# EAGLE design lcd (EAGLE 7.7.0)
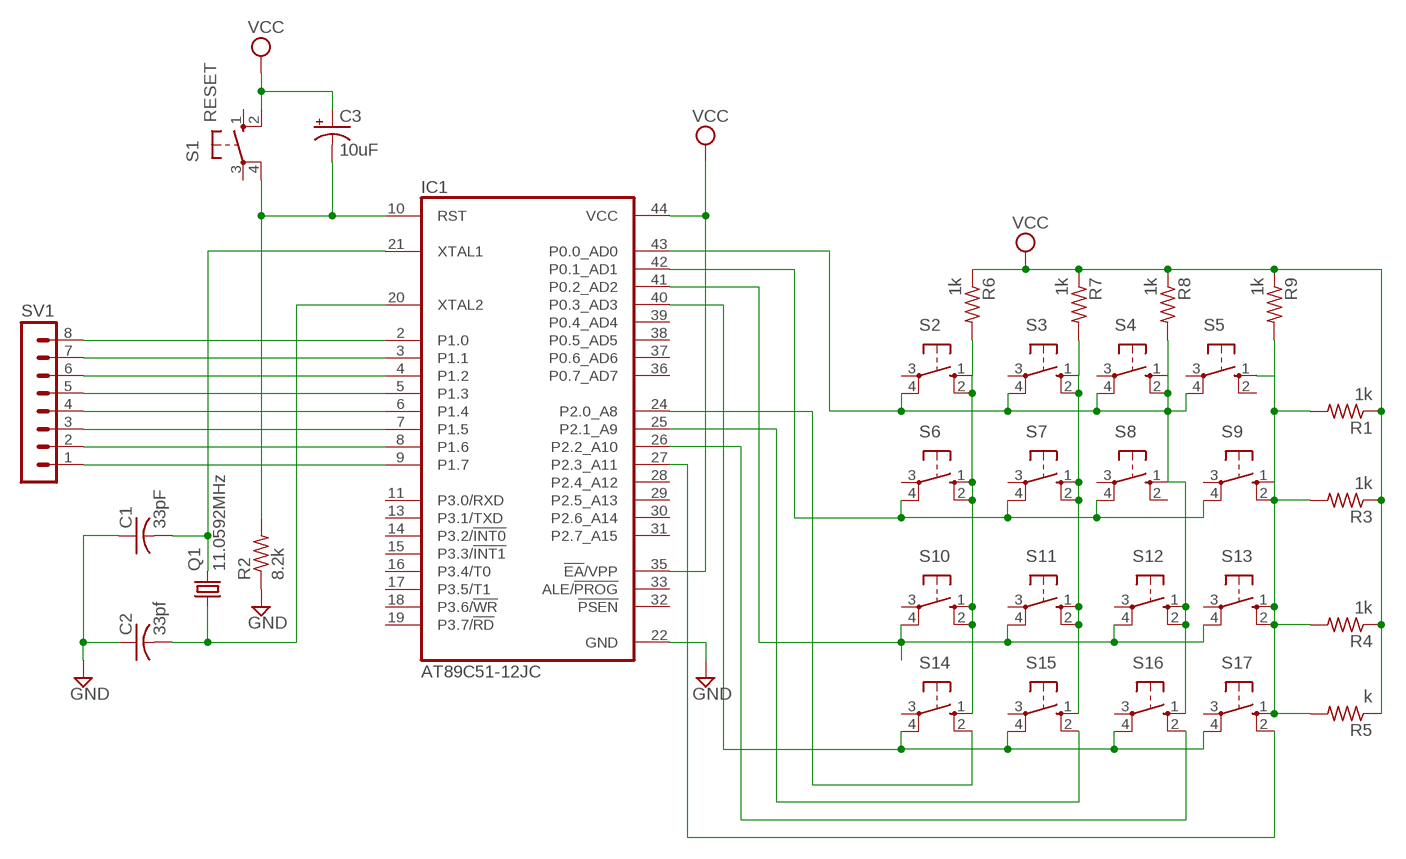
[diagram p0: schematic, sheet 1]

## Parts
C1  33pF  C-US025-025X050  [C025-025X050]
C2  33pf  C-US025-025X050  [C025-025X050]
C3  10uF  CPOL-USE2.5-5  [E2,5-5]
IC1  AT89C51-12JC  [PLCC44]
Q1  11.0592MHz  CRYSTALTC26H  [TC26H]
R1  1k  R-US_R2512  [R2512]
R2  8.2k  R-US_R2512  [R2512]
R3  1k  R-US_R2512  [R2512]
R4  1k  R-US_R2512  [R2512]
R5  k  R-US_R2512  [R2512]
R6  1k  R-US_R2512  [R2512]
R7  1k  R-US_R2512  [R2512]
R8  1k  R-US_R2512  [R2512]
R9  1k  R-US_R2512  [R2512]
S1  RESET  10-XX  [B3F-10XX]
S2  10-XX  [B3F-10XX]
S3  10-XX  [B3F-10XX]
S4  10-XX  [B3F-10XX]
S5  10-XX  [B3F-10XX]
S6  10-XX  [B3F-10XX]
S7  10-XX  [B3F-10XX]
S8  10-XX  [B3F-10XX]
S9  10-XX  [B3F-10XX]
S10  10-XX  [B3F-10XX]
S11  10-XX  [B3F-10XX]
S12  10-XX  [B3F-10XX]
S13  10-XX  [B3F-10XX]
S14  10-XX  [B3F-10XX]
S15  10-XX  [B3F-10XX]
S16  10-XX  [B3F-10XX]
S17  10-XX  [B3F-10XX]
SV1  MA08-1W  [MA08-1W]

## Nets
GND: C1.1 C2.1 IC1.22(GND) R2.1
N$1: IC1.9(P1.7) SV1.1
N$2: IC1.8(P1.6) SV1.2
N$3: IC1.7(P1.5) SV1.3
N$4: IC1.6(P1.4) SV1.4
N$5: IC1.5(P1.3) SV1.5
N$6: IC1.4(P1.2) SV1.6
N$7: IC1.3(P1.1) SV1.7
N$8: IC1.2(P1.0) SV1.8
N$9: IC1.43(P0.0_AD0) R8.2 S2.4(P1) S3.4(P1) S4.1(S) S4.2(S1) S4.4(P1) S5.4(P1) S8.1(S) S12.1(S) S12.2(S1) S16.1(S)
N$10: IC1.42(P0.1_AD1) S6.4(P1) S7.4(P1) S8.4(P1) S9.4(P1)
N$11: IC1.41(P0.2_AD2) S10.4(P1) S11.4(P1) S12.4(P1) S13.4(P1)
N$12: C1.2 IC1.21(XTAL1) Q1.2
N$13: C2.2 IC1.20(XTAL2) Q1.1
N$14: IC1.40(P0.3_AD3) S14.4(P1) S15.4(P1) S16.4(P1) S17.4(P1)
N$15: IC1.25(P2.1_A9) S15.2(S1)
N$17: C3.- IC1.10(RST) R2.2 S1.4(P1)
N$18: IC1.24(P2.0_A8) S14.2(S1)
N$19: R6.2 S2.1(S) S2.2(S1) S6.1(S) S6.2(S1) S10.1(S) S10.2(S1) S14.1(S)
N$20: R7.2 S3.1(S) S3.2(S1) S7.1(S) S7.2(S1) S11.1(S) S11.2(S1) S15.1(S)
N$22: R1.2 R3.2 R4.2 R5.2 R9.2 S5.1(S) S9.1(S) S9.2(S1) S13.1(S) S13.2(S1) S17.1(S)
N$24: IC1.26(P2.2_A10) S16.2(S1)
N$25: IC1.27(P2.3_A11) S17.2(S1)
VCC: C3.+ IC1.35(!EA!/VPP) IC1.44(VCC) R1.1 R3.1 R4.1 R5.1 R6.1 R7.1 R8.1 R9.1 S1.2(S1)
Unconnected: IC1.11(P3.0/RXD) IC1.13(P3.1/TXD) IC1.14(P3.2/!INT0) IC1.15(P3.3/!INT1) IC1.16(P3.4/T0) IC1.17(P3.5/T1) IC1.18(P3.6/!WR) IC1.19(P3.7/!RD) IC1.28(P2.4_A12) IC1.29(P2.5_A13) IC1.30(P2.6_A14) IC1.31(P2.7_A15) IC1.32(!PSEN) IC1.33(ALE/!PROG) IC1.36(P0.7_AD7) IC1.37(P0.6_AD6) IC1.38(P0.5_AD5) IC1.39(P0.4_AD4) S1.1(S) S1.3(P) S2.3(P) S3.3(P) S4.3(P) S5.2(S1) S5.3(P) S6.3(P) S7.3(P) S8.2(S1) S8.3(P) S9.3(P) S10.3(P) S11.3(P) S12.3(P) S13.3(P) S14.3(P) S15.3(P) S16.3(P) S17.3(P)

## Library data of the parts
C1 C2 = rcl:C-US: CAPACITOR, American symbol
C3 = rcl:CPOL-US: POLARIZED CAPACITOR, American symbol
IC1 = atmel:AT89C51-*: 8-bit Microcontroller with 4K Bytes Flash Not Recommended for New Designs. Use AT89S51. Source: http://www.atmel.com/dyn/resources/prod_documents/doc0265.; MPN: AT89C51ED2-SLSUM; OC_FARNELL: 1095722; OC_NEWARK: 78K5790
Q1 = crystal:CRYSTAL: CRYSTAL; OC_FARNELL: unknown; OC_NEWARK: unknown
R1-R9 = rcl:R-US_: RESISTOR, American symbol
S1-S17 = switch-omron:10-XX: OMRON SWITCH; MPN: B3F-1000; OC_FARNELL: 176432; OC_NEWARK: 36M3542
SV1 = con-lstb:MA08-1W: PIN HEADER; OC_FARNELL: unknown; OC_NEWARK: unknown

## Board
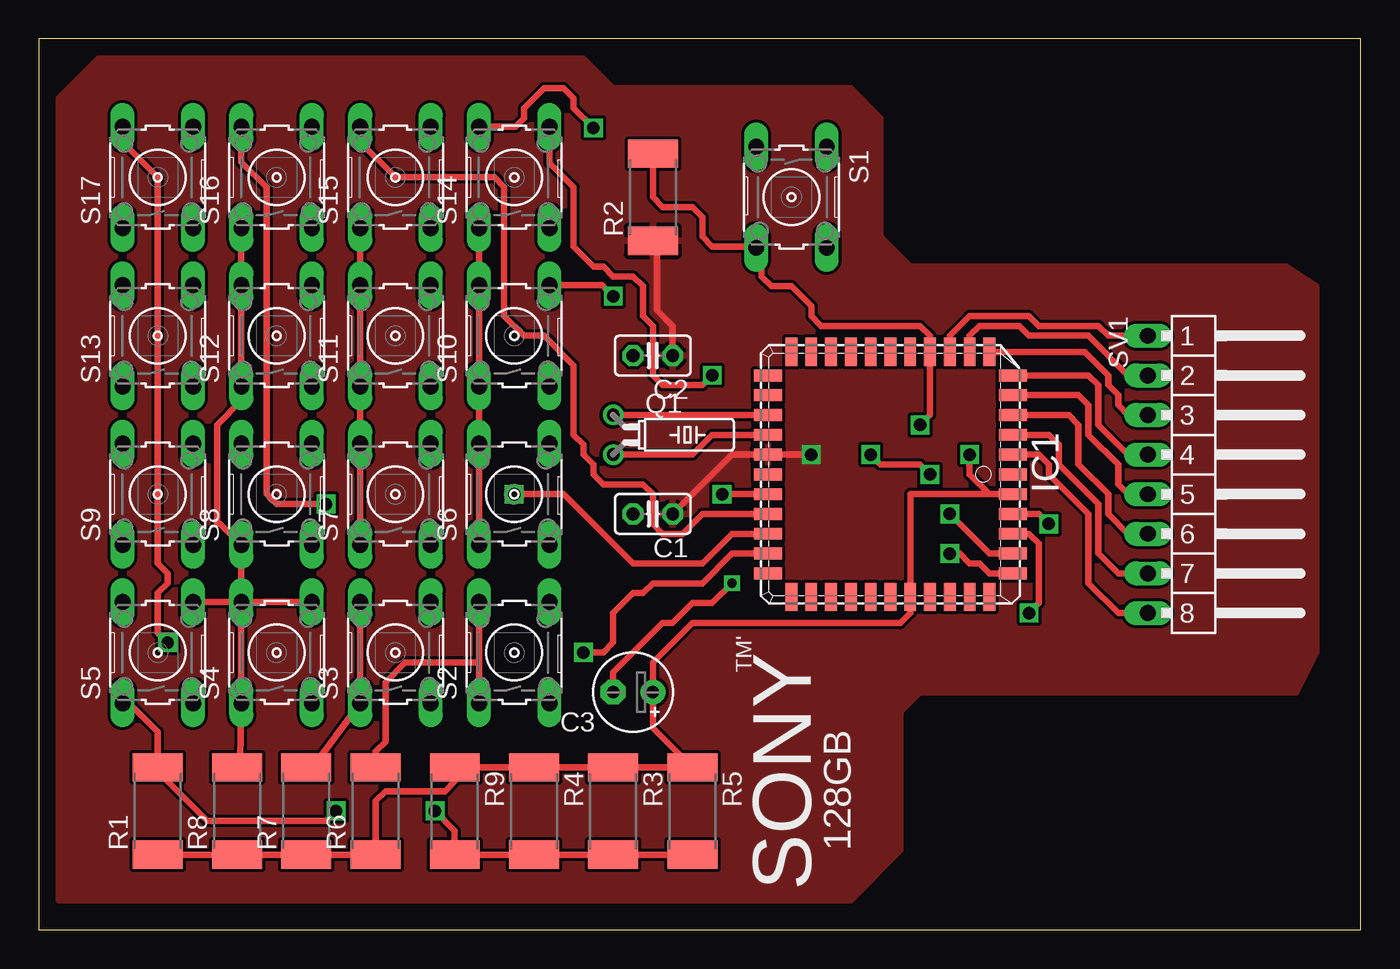
[diagram p1: board, top side]
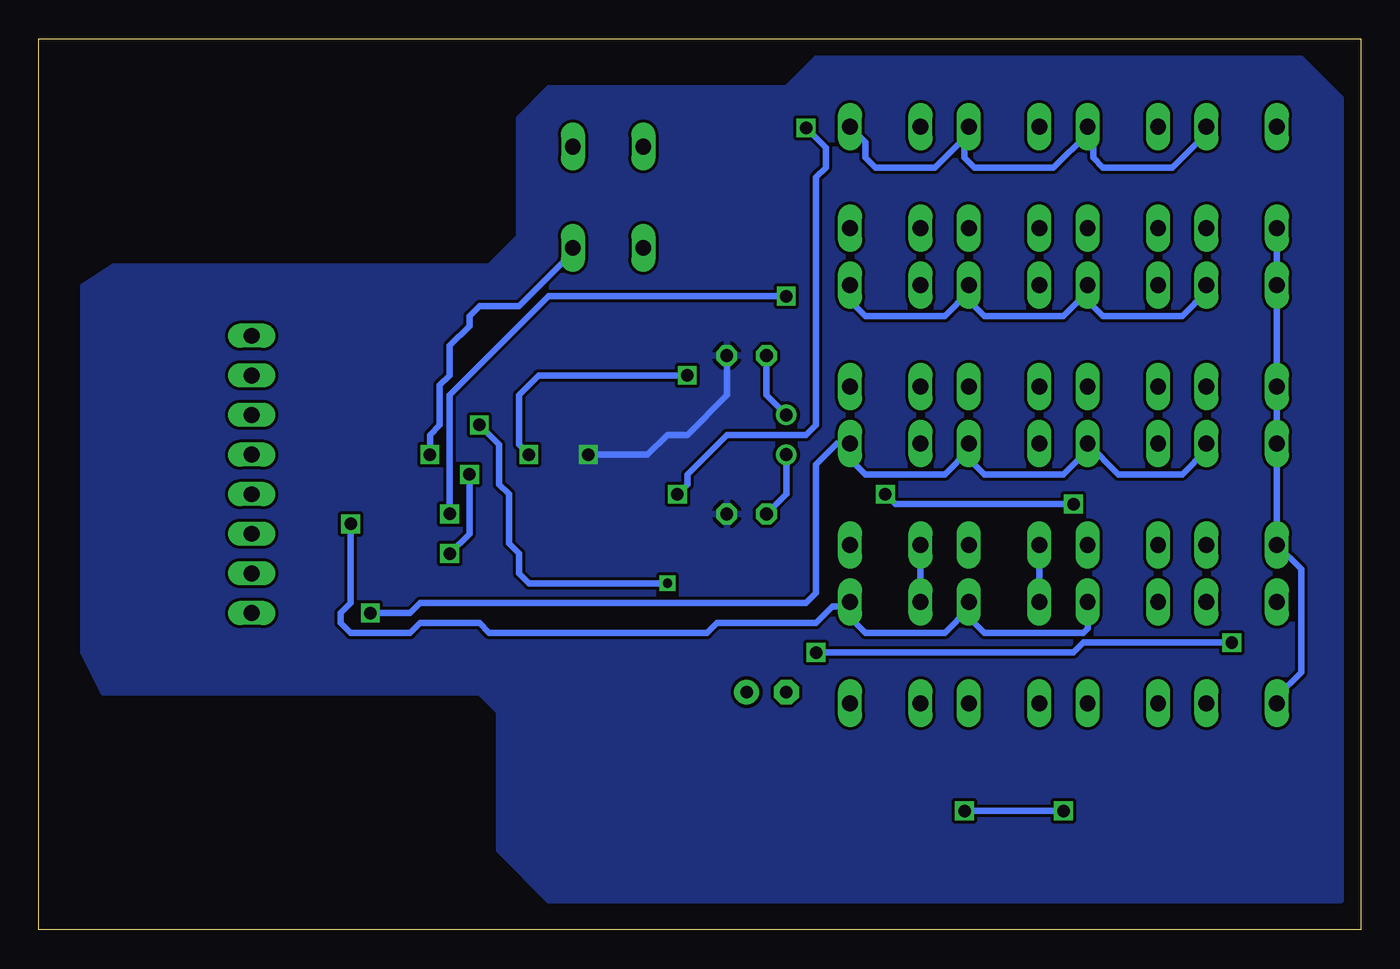
[diagram p2: board, bottom side, seen from below]

Size 84.76 x 57.14 mm. Coordinates in mm from the lower left corner, seen from the top.
Outline: 0,0 84.76,0 84.76,57.14 0,57.14 0,0
Copper layers (1*16): Top 0.035mm / dielectric 1.5mm / Bottom 0.035mm
Design rules "default": minimum track width 10mil, minimum drill 24mil, track to track 8mil, track to pad 8mil, pad to pad 8mil, via to via 8mil, smd to smd 8mil, copper to edge 40mil, drill to drill 8mil, minimum pad ring 10mil, minimum via ring 8mil, stop-mask expansion 4mil, vias tented up to drill 0mil, thermal gap 10mil

### Footprints (pad centres in the part's own frame; a part is rotated, then mirrored left to right if it is on the bottom)
C025-025X050 = drill 0.813 octagon: 1 -1.27,0; 2 1.27,0
E2,5-5 = drill 0.813 pad 1.6: + -1.27,0 | drill 0.813 pad 1.6 octagon: - 1.27,0
PLCC44 = smd 1.8 x 0.76: 1 -7.86,0; 2 -7.86,-1.27; 3 -7.86,-2.54; 4 -7.86,-3.81; 5 -7.86,-5.08; 6 -7.86,-6.35; 18 7.86,-6.35; 19 7.86,-5.08; 20 7.86,-3.81; 21 7.86,-2.54; 22 7.86,-1.27; 23 7.86,0; 24 7.86,1.27; 25 7.86,2.54; 26 7.86,3.81; 27 7.86,5.08; 28 7.86,6.35; 40 -7.86,6.35; 41 -7.86,5.08; 42 -7.86,3.81; 43 -7.86,2.54; 44 -7.86,1.27 | smd 0.76 x 1.8: 7 -6.35,-7.86; 8 -5.08,-7.86; 9 -3.81,-7.86; 10 -2.54,-7.86; 11 -1.27,-7.86; 12 0,-7.86; 13 1.27,-7.86; 14 2.54,-7.86; 15 3.81,-7.86; 16 5.08,-7.86; 17 6.35,-7.86; 29 6.35,7.86; 30 5.08,7.86; 31 3.81,7.86; 32 2.54,7.86; 33 1.27,7.86; 34 0,7.86; 35 -1.27,7.86; 36 -2.54,7.86; 37 -3.81,7.86; 38 -5.08,7.86; 39 -6.35,7.86
TC26H = drill 0.813: 1 -1.27,0; 2 1.27,0
R2512 = smd 1.8 x 3.2: 1 -2.8,0; 2 2.8,0
B3F-10XX = drill 1.016 long: 1 -3.251,2.261; 2 3.251,2.261; 3 -3.251,-2.261; 4 3.251,-2.261
MA08-1W = drill 1.016 long: 1 -8.89,0; 2 -6.35,0; 3 -3.81,0; 4 -1.27,0; 5 1.27,0; 6 3.81,0; 7 6.35,0; 8 8.89,0

### Placement (x,y rotation side)
C1  39.37,26.67 180 top
C2  39.37,36.83 180 top
C3  38.1,15.24 180 top
IC1  54.61,29.21 180 top
Q1  36.83,31.75 270 top
R1  7.62,7.62 90 top
R2  39.37,46.99 90 top
R3  36.83,7.62 270 top
R4  31.75,7.62 270 top
R5  41.91,7.62 270 top
R6  21.59,7.62 90 top
R7  17.14,7.62 90 top
R8  12.7,7.62 90 top
R9  26.67,7.62 270 top
S1  48.26,46.99 270 top
S2  30.48,17.78 90 top
S3  22.86,17.78 90 top
S4  15.24,17.78 90 top
S5  7.62,17.78 90 top
S6  30.48,27.94 90 top
S7  22.86,27.94 90 top
S8  15.24,27.94 90 top
S9  7.62,27.94 90 top
S10  30.48,38.1 90 top
S11  22.86,38.1 90 top
S12  15.24,38.1 90 top
S13  7.62,38.1 90 top
S14  30.48,48.26 90 top
S15  22.86,48.26 90 top
S16  15.24,48.26 90 top
S17  7.62,48.26 90 top
SV1  71.12,29.21 270 top

### Tracks (layer width: path | path; a pad name or v marks a point on that pad's centre or on a via)
GND  (via drill 0.8)
  Top 0.406: C1.1 44.45,30.48 IC1.22 v49.53,30.48 | R2.1 39.63,43.44 39.63,39.75 40.64,38.73 C2.1
  Bottom 0.406: v49.53,30.48 45.72,30.48 44.45,31.75 43.18,31.75 40.64,34.29 C2.1
  pour Top: 1.27,1.91 1.27,53.34 3.81,55.88 34.92,55.88 36.83,53.98 52.07,53.98 53.97,52.07 53.97,44.45 55.88,42.55 80.01,42.55 81.92,41.27 81.92,17.78 80.65,15.24 56.51,15.24 55.24,13.97 55.24,5.08 52.07,1.91
  pour Bottom: 1.27,1.91 1.27,53.34 3.81,55.88 34.92,55.88 36.83,53.98 52.07,53.98 53.97,52.07 53.97,44.45 55.88,42.55 80.01,42.55 81.92,41.27 81.92,17.78 80.65,15.24 56.51,15.24 55.24,13.97 55.24,5.08 52.07,1.91
N$1
  Top 0.406: SV1.1 68.58,38.1 67.95,38.73 64.14,38.73 63.5,39.37 59.69,39.37 58.42,38.1 IC1.9
N$2
  Top 0.406: SV1.2 69.85,35.56 67.31,38.1 63.5,38.1 62.87,38.73 60.32,38.73 59.69,38.1 IC1.8
N$3
  Top 0.406: IC1.7 67.07,37.07 68.58,35.56 68.58,34.93 69.22,34.29 69.22,33.66 69.85,33.02 SV1.3
N$4
  Top 0.406: IC1.6 67.31,35.56 67.95,34.93 67.95,32.39 69.85,30.48 SV1.4
N$5
  Top 0.406: IC1.5 66.67,34.29 67.31,33.66 67.31,31.75 69.22,29.84 69.22,28.58 69.85,27.94 SV1.5
N$6
  Top 0.406: IC1.4 66.04,33.02 66.67,32.39 66.67,29.84 68.58,27.94 68.58,26.67 69.85,25.4 SV1.6
N$7
  Top 0.406: IC1.3 64.77,31.75 65.41,31.12 65.41,29.84 67.95,27.3 67.95,24.13 69.22,22.86 SV1.7 71.76,22.86
N$8
  Top 0.406: IC1.2 64.14,30.48 64.77,29.84 64.77,29.21 67.31,26.67 67.31,22.23 69.22,20.32 SV1.8
N$9  (via drill 0.8)
  Top 0.406: S16.1 S12.2 S12.1 12.98,33.93 11.43,32.39 11.43,26.03 11.63,26.03 S8.1 S4.2 | S4.2 S4.1 12.9,10.79 13.34,10.79 R8.2 | S4.2 S4.4 | S5.4 S4.2 | v64.77,26.03 64.14,26.67 IC1.43
  Bottom 0.406: S4.4 17.5,19.33 17.78,19.05 24.13,19.05 25.4,20.32 25.4,20.75 S3.4 25.12,20.6 26.67,19.05 31.75,19.05 33.02,20.32 33.02,20.75 | 33.02,20.75 S2.4 | 33.02,20.75 33.86,20.75 34.92,19.69 41.27,19.69 41.91,19.05 55.88,19.05 56.51,19.69 60.32,19.69 60.96,19.05 64.77,19.05 65.41,19.69 65.41,20.32 64.77,20.95 v64.77,26.03
N$10  (via drill 0.8)
  Top 0.406: IC1.42 63.5,25.4 64.14,24.77 64.14,20.95 v63.5,20.32
  Bottom 0.406: S9.4 9.88,30.76 11.43,29.21 15.52,29.21 S8.4 17.5,30.76 19.05,29.21 24.13,29.21 25.4,30.48 25.4,30.91 S7.4 25.12,30.76 26.67,29.21 31.75,29.21 33.02,30.48 33.02,30.91 S6.4 33.58,31.19 34.92,29.84 34.92,21.59 35.56,20.95 60.32,20.95 60.96,20.32 v63.5,20.32
N$11  (via drill 0.8)
  Top 0.406: S10.4 36.12,41.35 v36.83,40.64 | v58.42,26.67 60.96,24.13 IC1.41
  Bottom 0.406: S13.4 9.88,40.92 11.43,39.37 16.51,39.37 17.78,40.64 17.78,41.07 S12.4 17.5,40.92 19.05,39.37 24.13,39.37 25.4,40.64 25.4,41.07 S11.4 25.12,40.92 26.67,39.37 31.75,39.37 33.02,40.64 33.02,41.07 S10.4 | v36.83,40.64 52.07,40.64 58.42,34.29 v58.42,26.67
N$12
  Top 0.406: Q1.2 41.91,30.48 43.18,31.75 IC1.21
  Bottom 0.406: Q1.2 36.83,27.94 C1.2
N$13
  Top 0.406: IC1.20 Q1.1
  Bottom 0.406: C2.2 38.1,34.29 Q1.1
N$14  (via drill 0.8)
  Top 0.406: v43.18,35.56 42.54,34.93 40,34.93 39.37,35.56 39.37,38.73 38.73,39.37 38.73,41.27 38.1,41.91 36.83,41.91 36.2,42.55 35.56,42.55 34.29,43.82 34.29,47.62 32.74,49.17 S14.4 | v53.34,30.48 53.97,29.84 56.51,29.84 v57.15,29.21 | v58.42,24.13 59.05,24.13 59.69,23.49 60.32,23.49 60.96,22.86 IC1.40
  Bottom 0.406: v43.18,35.56 52.7,35.56 53.97,34.29 53.97,31.12 v53.34,30.48 | v57.15,29.21 57.15,25.4 v58.42,24.13 | S17.4 9.88,51.08 12.07,48.9 16.51,48.9 17.14,49.53 17.14,51.16 S16.4 17.5,51.08 19.68,48.9 24.77,48.9 25.4,49.53 25.4,51.23 S15.4 25.12,51.08 27.3,48.9 31.11,48.9 31.75,49.53 31.75,50.52 S14.4
N$15
  Top 0.406: S15.2 20.6,50.52 22.86,48.26 29.21,48.26 29.84,47.62 29.84,39.37 31.11,38.1 32.38,38.1 34.29,36.2 34.29,31.75 34.92,31.12 34.92,30.48 35.56,29.84 35.56,29.21 36.2,28.58 38.73,28.58 39.37,27.94 39.37,26.03 40,25.4 41.27,25.4 42.54,26.67 IC1.25
N$17  (via drill 0.6, 0.8)
  Top 0.406: C3.- 36.83,16.51 40,19.69 40.64,19.69 41.91,20.95 43.18,20.95 v44.45,22.23 | v56.51,32.39 57.15,33.02 IC1.10 57.15,38.1 56.51,38.73 50.16,38.73 49.53,39.37 49.53,40.01 48.26,41.27 46.99,41.27 46.35,41.91 46.35,43.38 S1.4 45.92,43.82 43.18,43.82 42.54,44.45 42.54,45.72 41.91,46.36 40,46.36 39.37,46.99 R2.2
  Bottom 0.406: v44.45,22.23 53.34,22.23 53.97,22.86 53.97,24.13 54.61,24.77 54.61,27.94 55.24,28.58 55.24,31.12 v56.51,32.39
N$18  (via drill 0.8)
  Top 0.406: v43.81,27.94 IC1.24 | S14.2 30.56,51.51 31.11,52.07 31.11,52.7 32.38,53.98 33.65,53.98 34.29,53.34 34.29,52.7 v35.56,51.44
  Bottom 0.406: v43.81,27.94 43.18,28.58 43.18,29.21 40.64,31.75 35.56,31.75 34.92,32.39 34.92,48.26 34.29,48.9 34.29,50.16 v35.56,51.44
N$19
  Top 0.406: S14.1 S10.2 S10.1 S6.2 S6.1 | S2.2 28.22,17.15 | 28.22,17.15 S2.1 28.65,13.89 | R6.2 21.21,10.16 21.59,10.16 21.59,11.43 22.23,12.06 22.23,15.87 23.5,17.15 28.22,17.15
  Bottom 0.406: S6.1 S2.2
N$20
  Top 0.406: S3.2 20.6,15.52 20.32,15.24 20.32,14.81 S3.1 17.35,10.16 17.14,10.79 16.89,10.42 R7.2 | S7.1 S7.2 S11.1 S11.2 S15.1
  Bottom 0.406: S7.1 S3.2
N$22  (via drill 0.8)
  Top 0.406: 26.04,4.45 26.3,4.45 R9.2 | R9.2 R4.2 R3.2 R5.2 | S5.1 5.79,14.53 7.62,12.7 R1.2 7.62,10.16 10.79,6.98 18.41,6.98 v19.05,7.62 | v25.4,7.62 26.67,6.35 R9.2
  Bottom 0.406: S5.1 5.36,14.96 3.81,16.51 3.81,23.14 S9.1 S9.2 S13.1 S13.2 S17.1 | v19.05,7.62 v25.4,7.62
N$24  (via drill 0.8)
  Top 0.406: S16.2 12.98,49.25 14.61,47.62 14.61,27.94 15.24,27.3 v18.41,27.3 | v30.48,27.94 33.65,27.94 38.1,23.49 42.54,23.49 44.45,25.4 IC1.26
  Bottom 0.406: v18.41,27.3 29.84,27.3 v30.48,27.94
N$25  (via drill 0.8)
  Top 0.406: S17.2 5.36,50.52 7.62,48.26 7.62,23.49 8.26,22.86 8.26,22.23 7.62,21.59 7.62,19.05 v8.26,18.41 | v34.92,17.78 36.2,17.78 36.83,18.41 36.83,20.32 38.1,21.59 38.73,21.59 39.37,22.23 42.54,22.23 44.45,24.13 IC1.27
  Bottom 0.406: v8.26,18.41 17.78,18.41 18.41,17.78 v34.92,17.78
VCC  (via drill 0.8)
  Top 0.406: R1.1 R8.1 R7.1 R6.1 21.59,8.26 22.23,8.89 26.04,8.89 26.67,9.53 R9.1 R4.1 R3.1 R5.1 | 60.96,27.94 55.88,27.94 IC1.35 55.88,20.32 55.24,19.69 41.91,19.69 39.37,17.15 C3.+ 39.37,12.96 R5.1 | 60.96,27.94 IC1.44 | v59.69,30.48 59.69,29.21 60.96,27.94 | R5.1 42.17,10.42 42.54,10.79 42.28,10.79 R5.1
  Bottom 0.406: S1.2 50.52,43.46 53.97,40.01 56.51,40.01 57.15,39.37 57.15,38.73 58.42,37.47 58.42,35.56 59.05,34.93 59.05,32.39 59.69,31.75 v59.69,30.48

### Text on the board
tPlace: TM' | 128GB | SONY